# Altium project STM32_IMU_DataLogger.PrjPcb
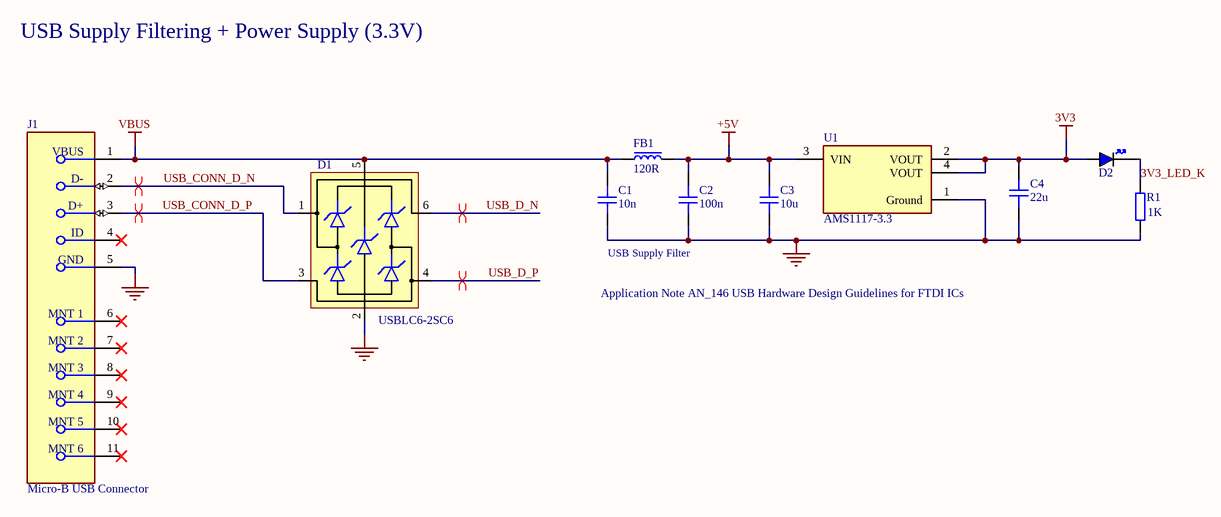
[diagram p0: Power.SchDoc]
4 sheets, 44 parts. Net scope: global (net labels, ports and power ports of the same name join across sheets).
Board file: STM32_IMU_DataLogger.PcbDoc
Sheets:
  Power.SchDoc
  MCU.SchDoc
  MCU_Power.SchDoc
  Peripherals.SchDoc

## Sheet Power.SchDoc
size A4; SheetNumber: 1; SheetTotal: 4

### Parts
C1  10n  [CAP_0603]
C2  100n  [CAP_0603]
C3  10u  [CAP_0603]
C4  22u  [CAP_0603]
D1  USBLC6-2SC6  [SOT-23-6]
D2  BLUE  [LED_0402_BLUE]  (value not drawn)
FB1  120R  [FB_0603]
J1  Micro-B USB Connector  [FP-473460001-MFG]
R1  1K  [RES_0402]
U1  AMS1117-3.3  [FP-AMS1117-IPC_C]

### Nets
3V3: C4.2 D2.A U1.2(VOUT) U1.4(VOUT)
+5V: C2.2 C3.2 FB1.2 U1.3(VIN)
GND: C1.1 C2.1 C3.1 C4.1 D1.2(GND) J1.5(GND) R1.2 U1.1(Ground)
VBUS: C1.2 D1.5(VBUS) FB1.1 J1.1(VBUS)
3V3_LED_K: D2.K R1.1
USB_CONN_D_N: D1.1(IO1) J1.2(D-)
USB_CONN_D_P: D1.3(IO2) J1.3(D+)
USB_D_N: D1.6(IO1)
USB_D_P: D1.4(IO2)

Not connected (* = marked no-connect by the designer): J1 4(ID)* 6(MNT_1)* 7(MNT_2)* 8(MNT_3)* 9(MNT_4)* 10(MNT_5)* 11(MNT_6)*

### Layout directives
differential pair: USB_CONN_D_N, USB_CONN_D_P, USB_D_N, USB_D_P

### Notes on the sheet
- USB Supply Filtering + Power Supply (3.3V)
- Application Note AN_146 USB Hardware Design Guidelines for FTDI ICs
- USB Supply Filter

### Library data of the parts
C1-C4 = CAP_0603: Capacitor SMD 0603; Manufacturer: *; Manufacturer Part Number: *; Distributor Link: *; LCSC: *; Rating: *; Dielectric: *
D1 = USBLC6-2SC6: Low-Capacitance ESD Protection USB; Manufacturer: STMicroelectronics; Manufacturer Part Number: USBLC6-2SC6; Distributor Link: https://www.mouser.de/ProductDetail/STMicroelectronics/USBLC6-2SC6?qs=po45yt2pPpu%2FhNIlwQdTlg%3D%3D
D2 = LED_0402_BLUE: LED 0402 BLUE SMD
FB1 = FB_0603: Ferrite Bead SMD 0603; Manufacturer: *; Manufacturer Part Number: *; Distributor Link: *; LCSC: *
J1 = CMP-2000-05246-2: CONN RCPT USB2.0 MICRO B SMD R/A; Manufacturer: Molex; Manufacturer Part Number: 473460001; Conn Orientation: Right Angle; Is Female: yes; Shielding: true; Pitch: 0.65mm; Number Of Contacts: 5; Voltage Rating: 30V; Current Rating: 1.8A; Device Class L2: USB Connectors; Digikey Description: CONN RCPT USB2.0 MICRO B SMD R/A; Height: 2.945mm; RoHS: TRUE; ComponentLink2Description: Datasheet; Octopart: https://octopart.com/47346-0001-molex-7164928; Automotive: No; Package: 0; Category: Conn; Device Class L1: Connectors; Usb Standard: USB 2.0; Temperature: -30°C to +85°C; Temperature Range Low: -30°C; Footprint Url: https://www.molex.com/pdm_docs/sd/473460001_sd.pdf; ComponentLink2URL: https://www.molex.com/webdocs/datasheets/pdf/en-us/0473460001_IO_CONNECTORS.pdf; Lead Free: Yes; Contact Material: Gold,Nickel; Temperature Range High: +85°C; Device Class L3: unset
R1 = RES_0402: Resistor SMD 0402; Manufacturer: *; Manufacturer Part Number: *; Distributor Link: *; LCSC: *
U1 = CMP-209535-000001-1: LDO Voltage Regulators 1A, 3.3V; Manufacturer: Advanced Monolithic Systems; Dropout Voltage: 1.1V; Output Type: Fixed; Nominal Supply Current: 5mA; Max Power Dissipation: 1.2W; Max Supply Voltage: 15V; Number Of Outputs: 1; Standoff Height: 0.64mm; Max Junction Temp: +125°C; Height: 1.8mm; Package: AMS1117; Device Class L2: Power Management ICs; ComponentLink2Description: Datasheet; ComponentLink2URL: http://www.advanced-monolithic.com/pdf/ds1117.pdf; Category: IC; RoHS: TRUE; Automotive: No; Device Class L1: Integrated Circuits (ICs); Output Current: 1A; Device Class L3: Voltage Regulators - Linear; Temperature: -40°C to +125°C; Output Voltage: 3.3V; Manufacturer Part Number: AMS1117-3.3; Temperature Range Low: -40°C; Octopart: https://octopart.com/ams1117-3.3-advanced+monolithic+systems-25899300; Lead Free: Yes; Ipc Land Pattern Name: SOT229P700X180-4; Temperature Range High: +125°C

## Sheet MCU.SchDoc
size A4; SheetNumber: 2; SheetTotal: 4
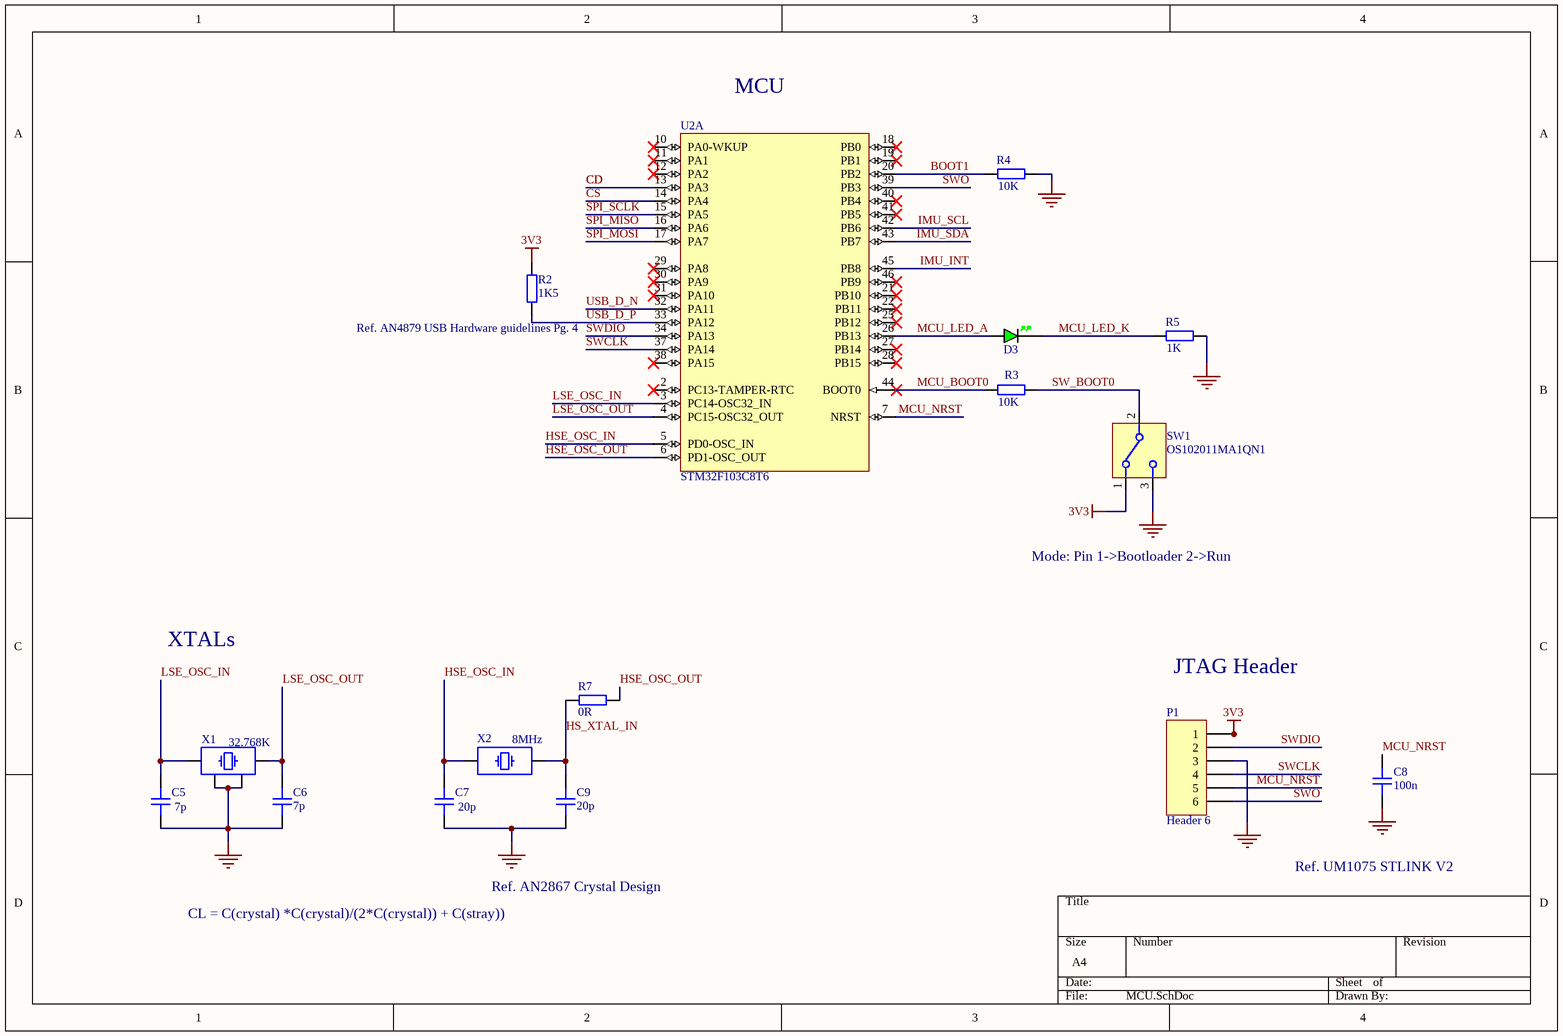
[diagram p1: MCU.SchDoc]

### Parts
C5  7p  [CAP_0402]
C6  7p  [CAP_0402]
C7  20p  [CAP_0402]
C8  100n  [CAP_0402]
C9  20p  [CAP_0402]
D3  GREEN  [LED_0402_GREEN]  (value not drawn)
P1  Header 6  [HDR1X6]
R2  1K5  [RES_0402]
R3  10K  [RES_0402]
R4  10K  [RES_0402]
R5  1K  [RES_0402]
R7  0R  [RES_0402]
SW1  OS102011MA1QN1  [OS102011MA1QN1]
U2  STM32F103C8T6  [STM-LQFP48_L]  (part A of 2)
X1  32.768K  [XTAL_2520]
X2  8MHz  [XTAL_3215-2]

### Nets
3V3: P1.1 R2.1 SW1.1
GND: C5.1 C6.1 C7.1 C8.1 C9.1 P1.3 R4.1 R5.1 SW1.3 X1.2 X1.4
BOOT1: R4.2 U2.20(PB2)
CD: U2.13(PA3)
CS: U2.14(PA4)
HS_XTAL_IN: C9.2 R7.1 X2.2
HSE_OSC_IN: C7.2 U2.5(PD0-OSC_IN) X2.1
HSE_OSC_OUT: R7.2 U2.6(PD1-OSC_OUT)
IMU_INT: U2.45(PB8)
IMU_SCL: U2.42(PB6)
IMU_SDA: U2.43(PB7)
LSE_OSC_IN: C5.2 U2.3(PC14-OSC32_IN) X1.1
LSE_OSC_OUT: C6.2 U2.4(PC15-OSC32_OUT) X1.3
MCU_BOOT0: R3.2 U2.44(BOOT0)
MCU_LED_A: D3.A U2.26(PB13)
MCU_LED_K: D3.K R5.2
MCU_NRST: C8.2 P1.5 U2.7(NRST)
SPI_MISO: U2.16(PA6)
SPI_MOSI: U2.17(PA7)
SPI_SCLK: U2.15(PA5)
SW_BOOT0: R3.1 SW1.2(COM)
SWCLK: P1.4 U2.37(PA14)
SWDIO: P1.2 U2.34(PA13)
SWO: P1.6 U2.39(PB3)
USB_D_N: U2.32(PA11)
USB_D_P: R2.2 U2.33(PA12)

Not connected (* = marked no-connect by the designer): U2 2(PC13-TAMPER-RTC)* 10(PA0-WKUP)* 11(PA1)* 12(PA2)* 18(PB0)* 19(PB1)* 21(PB10)* 22(PB11)* 25(PB12)* 27(PB14)* 28(PB15)* 29(PA8)* 30(PA9)* 31(PA10)* 38(PA15)* 40(PB4)* 41(PB5)* 46(PB9)*

### Notes on the sheet
- (near U2) MCU
- (near R2) Ref. AN4879 USB Hardware guidelines Pg. 4
- Mode: Pin 1->Bootloader 2->Run
- XTALs
- JTAG Header
- CL = C(crystal) *C(crystal)/(2*C(crystal)) + C(stray))
- Ref. AN2867 Crystal Design
- Ref. UM1075 STLINK V2

### Library data of the parts
C5-C9 = CAP_0402: Capacitor SMD 0402; Manufacturer: *; Manufacturer Part Number: *; Distributor Link: *; LCSC: *; Rating: *; Dielectric: *
D3 = LED_0402_GREEN: LED 0402 GREEN SMD
P1 = Header 6: Header, 6-Pin; LatestRevisionDate: 17-Jul-2002; LatestRevisionNote: Re-released for DXP Platform.; Publisher: Altium Limited
R2-R5 R7 = RES_0402: Resistor SMD 0402; Manufacturer: *; Manufacturer Part Number: *; Distributor Link: *; LCSC: *
SW1 = OS102011MA1QN1: Slide Switch SPDT Horizontal THT; Manufacturer: C&K; Manufacturer Part Number: OS102011MA1QN1
U2 = CMP-0237-00215-3: ARM Cortex-M3 32-bit MCU, 64 KB Flash, 20 KB Internal RAM, 37 I/Os, 48-pin LQFP, -40 to 85 degC, Tray; Supply Voltage(Vcc) min (V): 2; Internal RAM Size (kB): 20; FLASH Size (Prog) (kB): 64; A/D Converter: 2x12-bit (10 Channel); I/Os (High Current): 37; Operating Frequency(F) (Processor speed) (MHz): 72; Core: ARM Cortex-M3; ComponentLink3Description: Package Specification; Mounting Technology: Surface Mount; PartNumber: STM32F103C8T6; PackageReference: LQFP48; Packing: Tray; ComponentLink3URL: http://www.st.com/st-web-ui/static/active/en/resource/technical/document/datasheet/DM00058181.pdf; DatasheetVersion: Rev. 16; ComponentLink1URL: http://www.st.com/web/en/home.html; PackageVersion: Rev. 6, 06/2013; ComponentLink2URL: http://www.st.com/st-web-ui/static/active/en/resource/technical/document/datasheet/CD00161566.pdf; ComponentLink1Description: Manufacturer URL; ComponentLink2Description: Datasheet; PackageDescription: 48-Pin Low Profile Quad Flat Package, 7 x 7 mm Body, 0.5 mm Pitch
X1 = XTAL_2520: Crystal SMD 2520; Distributor Link: *
X2 = XTAL_3215: Crystal SMD 3215; Distributor Link: *

## Sheet MCU_Power.SchDoc
size A4; SheetNumber: 3; SheetTotal: 4
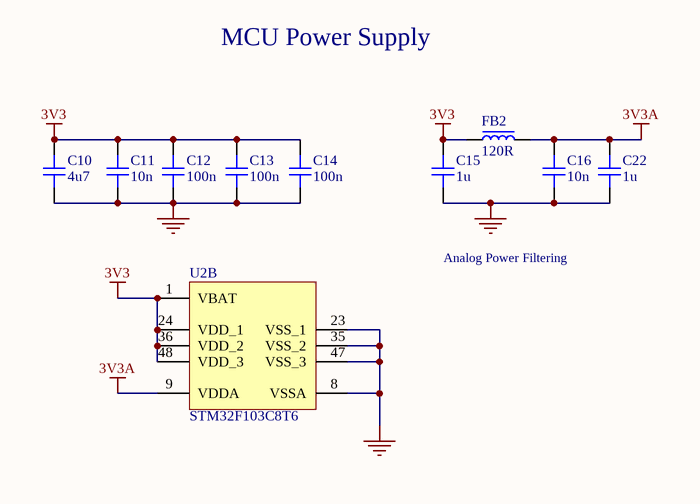
[diagram p2: MCU_Power.SchDoc]

### Parts
C10  4u7  [CAP_0603]
C11  10n  [CAP_0402]
C12  100n  [CAP_0402]
C13  100n  [CAP_0402]
C14  100n  [CAP_0402]
C15  1u  [CAP_0402]
C16  10n  [CAP_0402]
C22  1u  [CAP_0402]
FB2  120R  [FB_0603]
U2  STM32F103C8T6  [STM-LQFP48_L]  (part B of 2)

### Nets
3V3: C10.2 C11.2 C12.2 C13.2 C14.2 C15.2 FB2.1 U2.1(VBAT) U2.24(VDD_1) U2.36(VDD_2) U2.48(VDD_3)
3V3A: C16.2 C22.2 FB2.2 U2.9(VDDA)
GND: C10.1 C11.1 C12.1 C13.1 C14.1 C15.1 C16.1 C22.1 U2.8(VSSA) U2.23(VSS_1) U2.35(VSS_2) U2.47(VSS_3)

### Notes on the sheet
- MCU Power Supply
- Analog Power Filtering

### Library data of the parts
C10 = CAP_0603: Capacitor SMD 0603; Manufacturer: *; Manufacturer Part Number: *; Distributor Link: *; LCSC: *; Rating: *; Dielectric: *
C11-C16 C22 = CAP_0402: Capacitor SMD 0402; Manufacturer: *; Manufacturer Part Number: *; Distributor Link: *; LCSC: *; Rating: *; Dielectric: *
FB2 = FB_0603: Ferrite Bead SMD 0603; Manufacturer: *; Manufacturer Part Number: *; Distributor Link: *; LCSC: *
U2 = CMP-0237-00215-3: as U2 on sheet MCU; Core: ARM Cortex-M3; ComponentLink3Description: Package Specification; Mounting Technology: Surface Mount; PartNumber: STM32F103C8T6; PackageReference: LQFP48; Packing: Tray; ComponentLink3URL: http://www.st.com/st-web-ui/static/active/en/resource/technical/document/datasheet/DM00058181.pdf; DatasheetVersion: Rev. 16; ComponentLink1URL: http://www.st.com/web/en/home.html; PackageVersion: Rev. 6, 06/2013; ComponentLink2URL: http://www.st.com/st-web-ui/static/active/en/resource/technical/document/datasheet/CD00161566.pdf; ComponentLink1Description: Manufacturer URL; ComponentLink2Description: Datasheet; PackageDescription: 48-Pin Low Profile Quad Flat Package, 7 x 7 mm Body, 0.5 mm Pitch

## Sheet Peripherals.SchDoc
size A4; SheetNumber: 4; SheetTotal: 4
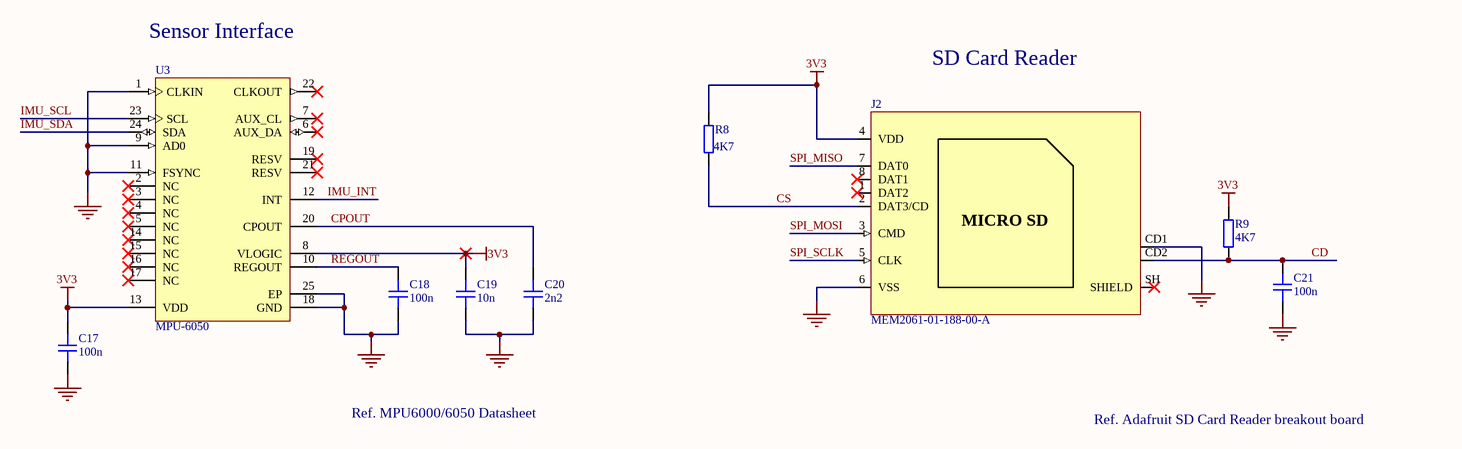
[diagram p3: Peripherals.SchDoc]

### Parts
C17  100n  [CAP_0402]
C18  100n  [CAP_0402]
C19  10n  [CAP_0402]
C20  2n2  [CAP_0402]
C21  100n  [CAP_0402]
J2  MEM2061-01-188-00-A  [MEM2061-01-188-00-A]
R8  4K7  [RES_0402]
R9  4K7  [RES_0402]
U3  MPU-6050  [IS-QFN-24_V]

### Nets
3V3: C17.2 C19.2 J2.4(VDD) R8.2 R9.2 U3.8(VLOGIC) U3.13(VDD)
GND: C17.1 C18.1 C19.1 C20.1 C21.1 J2.6(VSS) J2.CD1(CARD_DETECT) U3.1(CLKIN) U3.9(AD0) U3.11(FSYNC) U3.18(GND) U3.25(EP)
CD: C21.2 J2.CD2(CARD_DETECT) R9.1
CPOUT: C20.2 U3.20(CPOUT)
CS: J2.2(DAT3/CD) R8.1
IMU_INT: U3.12(INT)
IMU_SCL: U3.23(SCL)
IMU_SDA: U3.24(SDA)
REGOUT: C18.2 U3.10(REGOUT)
SPI_MISO: J2.7(DAT0)
SPI_MOSI: J2.3(CMD)
SPI_SCLK: J2.5(CLK)

Not connected (* = marked no-connect by the designer): J2 1(DAT2)* 8(DAT1)* SH(SHIELD)*; U3 2(NC)* 3(NC)* 4(NC)* 5(NC)* 6(AUX_DA)* 7(AUX_CL)* 14(NC)* 15(NC)* 16(NC)* 17(NC)* 19(RESV)* 21(RESV)* 22(CLKOUT)*

### Notes on the sheet
- (near U3) Sensor Interface
- SD Card Reader
- Ref. MPU6000/6050 Datasheet
- Ref. Adafruit SD Card Reader breakout board
- (in symbol MEM2061-01-188-00-A) MICRO SD

### Library data of the parts
C17-C21 = CAP_0402: Capacitor SMD 0402; Manufacturer: *; Manufacturer Part Number: *; Distributor Link: *; LCSC: *; Rating: *; Dielectric: *
J2 = MEM2061-01-188-00-A: Micro SD Card Holder Push-Push SMD; Manufacturer: GCT; Manufacturer Part Number: MEM2061-01-188-00-A; Distributor Link: *; LCSC: *
R8 R9 = RES_0402: Resistor SMD 0402; Manufacturer: *; Manufacturer Part Number: *; Distributor Link: *; LCSC: *
U3 = CMP-1753-00002-2: 3-Axis Gyroscope, Accelerometer and a Digital Motion Processor(TM) (DMP), 2.375 to 3.46 V, -40 to 85 degC, 24-Pin QFN, RoHS, Tape and Reel; Manufacturer: InvenSense; Featured Product: MPU-60506-Axis,IntegratedI²CSolution; Other Names: 1428-1007-2 / MPU6050; Sensor Type: MotionTracking; Online Catalog: MPU-6000™Series; Unit PriceUSD: Digital; Datasheet Version: Rev. 3.3, 05/2012; Category: Sensors,Transducers; Datasheet URL: http://datasheet.octopart.com/MPU-6050-InvenSense-datasheet-14421344.pdf; Family: Multifunction; Standard Package: 5,000; Manufacturer URL: http://www.invensense.com/; Output Type: Digital; Dynamic Catalog: MPU-6000™Series

## Nets that join several sheets
3V3: Power (C4.2 D2.A U1.2 U1.4), MCU (P1.1 R2.1 SW1.1), MCU_Power (11 pins), Peripherals (7 pins)
GND: Power (8 pins), MCU (11 pins), MCU_Power (12 pins), Peripherals (12 pins)
CD: MCU (U2.13), Peripherals (C21.2 J2.CD2 R9.1)
CS: MCU (U2.14), Peripherals (J2.2 R8.1)
IMU_INT: MCU (U2.45), Peripherals (U3.12)
IMU_SCL: MCU (U2.42), Peripherals (U3.23)
IMU_SDA: MCU (U2.43), Peripherals (U3.24)
SPI_MISO: MCU (U2.16), Peripherals (J2.7)
SPI_MOSI: MCU (U2.17), Peripherals (J2.3)
SPI_SCLK: MCU (U2.15), Peripherals (J2.5)
USB_D_N: Power (D1.6), MCU (U2.32)
USB_D_P: Power (D1.4), MCU (R2.2 U2.33)